# Altium schematic sheet lcd_ex_cap_touch.SchDoc
size A4
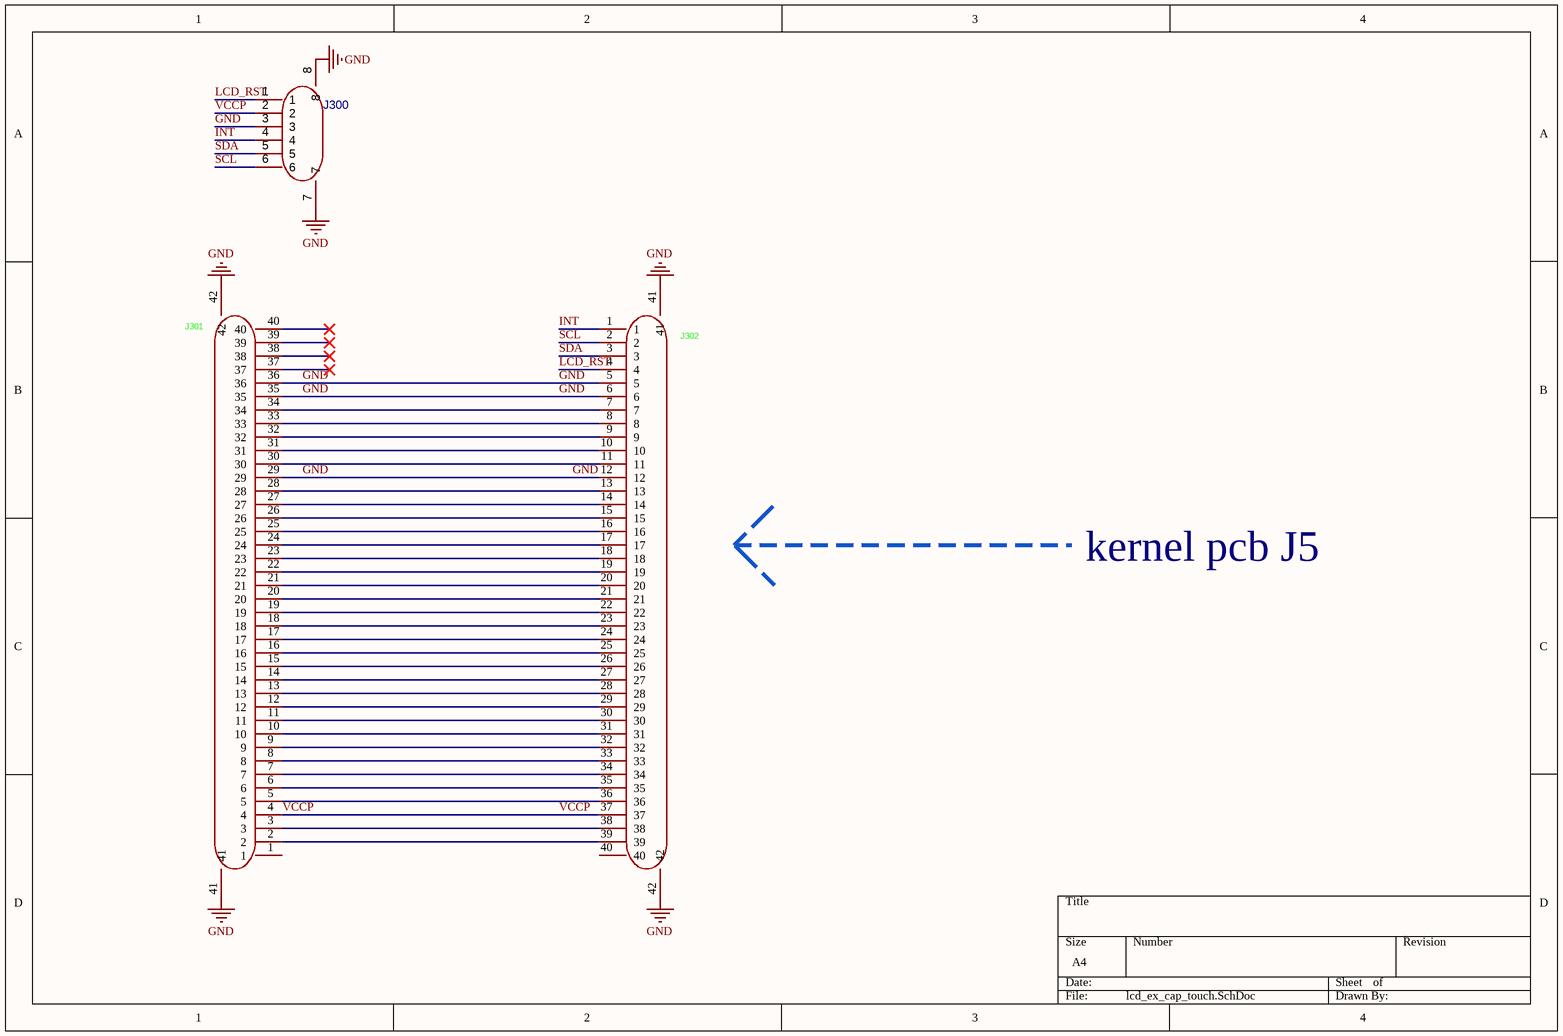
[diagram p0: lcd_ex_cap_touch.SchDoc]

## Parts
J300  (no value)  [FPC-SMD_P0.50-6P_QCHF-SM-H2.0_1]
J301  AFC01-S40FCA-00  [FPC-SMD_AFC01-S40FCA-00]  (value not drawn)
J302  AFC01-S40FCA-00  [FPC-SMD_AFC01-S40FCA-00]  (value not drawn)

## Nets
GND: J300.3 J300.7 J300.8 J301.29 J301.35 J301.36 J301.41 J301.42 J302.5 J302.6 J302.12 J302.41 J302.42
INT: J300.4 J302.1
LCD_RST: J300.1 J302.4
SCL: J300.6 J302.2
SDA: J300.5 J302.3
VCCP: J300.2 J301.4 J302.37
NetJ301_2: J301.2 J302.39
NetJ301_3: J301.3 J302.38
NetJ301_5: J301.5 J302.36
NetJ301_6: J301.6 J302.35
NetJ301_7: J301.7 J302.34
NetJ301_8: J301.8 J302.33
NetJ301_9: J301.9 J302.32
NetJ301_10: J301.10 J302.31
NetJ301_11: J301.11 J302.30
NetJ301_12: J301.12 J302.29
NetJ301_13: J301.13 J302.28
NetJ301_14: J301.14 J302.27
NetJ301_15: J301.15 J302.26
NetJ301_16: J301.16 J302.25
NetJ301_17: J301.17 J302.24
NetJ301_18: J301.18 J302.23
NetJ301_19: J301.19 J302.22
NetJ301_20: J301.20 J302.21
NetJ301_21: J301.21 J302.20
NetJ301_22: J301.22 J302.19
NetJ301_23: J301.23 J302.18
NetJ301_24: J301.24 J302.17
NetJ301_25: J301.25 J302.16
NetJ301_26: J301.26 J302.15
NetJ301_27: J301.27 J302.14
NetJ301_28: J301.28 J302.13
NetJ301_30: J301.30 J302.11
NetJ301_31: J301.31 J302.10
NetJ301_32: J301.32 J302.9
NetJ301_33: J301.33 J302.8
NetJ301_34: J301.34 J302.7

Not connected (* = marked no-connect by the designer): J301 1 37* 38* 39* 40*; J302 40

## Notes on the sheet
- kernel pcb J5

## Library data of the parts
J300 = AFC24-S06FIA-00: Symbol: AFC24-S06FIA-00
J301 J302 = AFC01-S40FCA-00: FPC; Manufacturer: JS(钜硕电子); Add into BOM: yes; Locking Feature: 翻盖式; Number of Contacts: 40P; Pitch: 0.5mm; FFC, FCB Thickness: 0.3mm; Symbol: AFC01-S40FCA-00; Device: AFC01-S40FCA-00; LCSC Part Name: 间距:0.5mm P数:40P 翻盖式 下接; Supplier Part: C262674; Manufacturer Part: AFC01-S40FCA-00; Supplier Footprint: SMD,P=0.5mm,卧贴; JLCPCB Part Class: Extended Part; Datasheet: https://item.szlcsc.com/datasheet/AFC01-S40FCA-00/253933.html; Supplier: LCSC; Convert to PCB: yes; Contact Type: 下接; Mounting Type: 卧贴; Height Above Board: 2mm